# EAGLE design v2-carb-sync-shield (EAGLE 6.4)
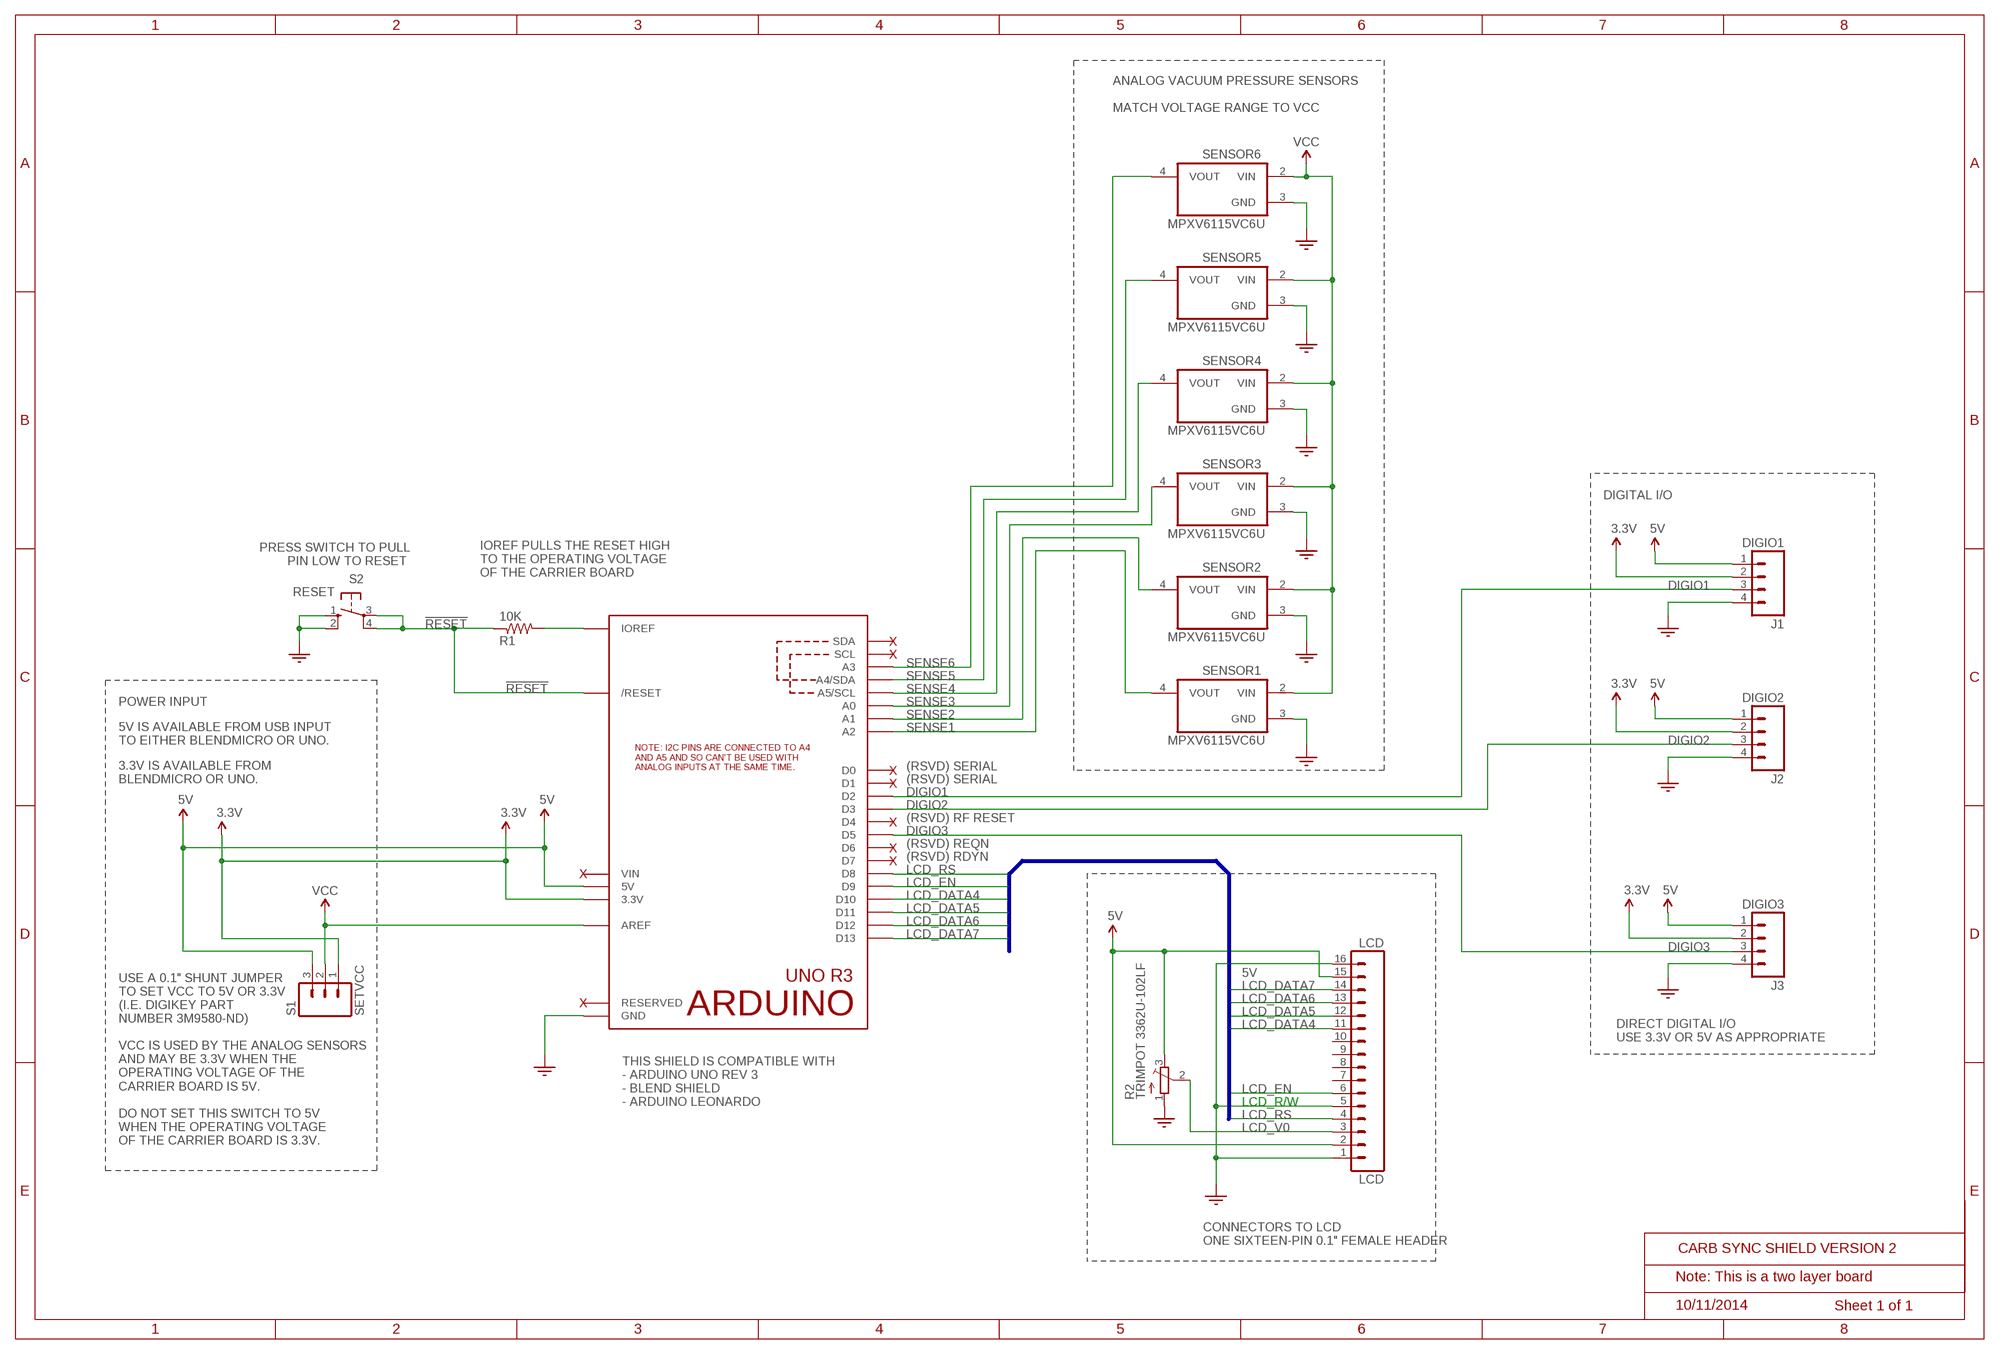
[diagram p0: schematic, sheet 1]

## Parts
J1  DIGIO1  M04LONGPADS  [1X04_LONGPADS]
J2  DIGIO2  M04LONGPADS  [1X04_LONGPADS]
J3  DIGIO3  M04LONGPADS  [1X04_LONGPADS]
LCD  LCD  CARBSYNCSHIELD_LCD  [CARBSYNCSHIELD_LCD]
R1  10K  R-US_0411/12  [0411/12]
R2  TRIMPOT 3362U-102LF  TRIMPOT3386  [TRIM-3386]
S1  SETVCC  M03LONGPADS  [1X03_LONGPADS]
S2  RESET  10-XX  [B3F-10XX]
SENSOR1  MPXV6115VC6U  [MPXV6115VC6U/T1-CASE482A]
SENSOR2  MPXV6115VC6U  [MPXV6115VC6U/T1-CASE482A]
SENSOR3  MPXV6115VC6U  [MPXV6115VC6U/T1-CASE482A]
SENSOR4  MPXV6115VC6U  [MPXV6115VC6U/T1-CASE482A]
SENSOR5  MPXV6115VC6U  [MPXV6115VC6U/T1-CASE482A]
SENSOR6  MPXV6115VC6U  [MPXV6115VC6U/T1-CASE482A]
U$13  ARDUINO-UNO-R3  [ARDUINO-UNO-R3-HOLES-NODIM]

## Nets
3.3V: J1.2 J2.2 J3.2 S1.1 U$13.3V(3.3V)
5V: J1.1 J2.1 J3.1 LCD.2 LCD.15 R2.3(E) S1.3 U$13.5V
!RESET: R1.1 S2.3(P) S2.4(P1) U$13.RESET(/RESET)
DIGIO1: J1.3 U$13.D2
DIGIO2: J2.3 U$13.D3
DIGIO3: J3.3 U$13.D5
GND: J1.4 J2.4 J3.4 LCD.1 LCD.5 LCD.16 R2.1(A) S2.1(S) S2.2(S1) SENSOR1.3(GND) SENSOR2.3(GND) SENSOR3.3(GND) SENSOR4.3(GND) SENSOR5.3(GND) SENSOR6.3(GND) U$13.GND U$13.GND1(GND) U$13.GND2(GND)
IOREF: R1.2 U$13.IOREF
LCD_DATA4: LCD.11 U$13.D10
LCD_DATA5: LCD.12 U$13.D11
LCD_DATA6: LCD.13 U$13.D12
LCD_DATA7: LCD.14 U$13.D13
LCD_EN: LCD.6 U$13.D9
LCD_RS: LCD.4 U$13.D8
LCD_V0: LCD.3 R2.2(S)
SENSE1: SENSOR1.4(VOUT) U$13.A2
SENSE2: SENSOR2.4(VOUT) U$13.A1
SENSE3: SENSOR3.4(VOUT) U$13.A0
SENSE4: SENSOR4.4(VOUT) U$13.A5(A5/SCL)
SENSE5: SENSOR5.4(VOUT) U$13.A4(A4/SDA)
SENSE6: SENSOR6.4(VOUT) U$13.A3
VCC: S1.2 SENSOR1.2(VIN) SENSOR2.2(VIN) SENSOR3.2(VIN) SENSOR4.2(VIN) SENSOR5.2(VIN) SENSOR6.2(VIN) U$13.AREF
Unconnected: LCD.7 LCD.8 LCD.9 LCD.10 U$13.D0 U$13.D1 U$13.D4 U$13.D6 U$13.D7 U$13.RESERVED U$13.SCL U$13.SDA

## Buses
LCD_RS,LCD_EN,LCD_DATA4,LCD_DATA5,LCD_DATA6,LCD_DATA7

## Notes on the sheet
- ANALOG VACUUM PRESSURE SENSORS
  
  MATCH VOLTAGE RANGE TO VCC
- DIGITAL I/O
- PRESS SWITCH TO PULL
  PIN LOW TO RESET
- IOREF PULLS THE RESET HIGH
  TO THE OPERATING VOLTAGE
  OF THE CARRIER BOARD
- X
- X
- POWER INPUT
- 5V IS AVAILABLE FROM USB INPUT
  TO EITHER BLENDMICRO OR UNO.
- X | (RSVD) SERIAL
- 3.3V IS AVAILABLE FROM 
  BLENDMICRO OR UNO.
- X | (RSVD) SERIAL
- X | (RSVD) RF RESET
- X | (RSVD) REQN
- X | (RSVD) RDYN
- X
- X
- DIRECT DIGITAL I/O 
  USE 3.3V OR 5V AS APPROPRIATE
- THIS SHIELD IS COMPATIBLE WITH
  - ARDUINO UNO REV 3
  - BLEND SHIELD
  - ARDUINO LEONARDO
- LCD_R/W
- USE A 0.1" SHUNT JUMPER 
  TO SET VCC TO 5V OR 3.3V
  (I.E. DIGIKEY PART 
  NUMBER 3M9580-ND)
  
  VCC IS USED BY THE ANALOG SENSORS
  AND MAY BE 3.3V WHEN THE 
  OPERATING VOLTAGE OF THE
  CARRIER BOARD IS 5V.
  
  DO NOT SET THIS SWITCH TO 5V
  WHEN THE OPERATING VOLTAGE
  OF THE CARRIER BOARD IS 3.3V.
- CONNECTORS TO LCD
  ONE SIXTEEN-PIN 0.1" FEMALE HEADER
- CARB SYNC SHIELD VERSION 2
- Note: This is a two layer board
- 10/11/2014 | Sheet 1 of 1

## Power pins joined to a net without a drawn wire
VIN: U$13.VIN

## Library data of the parts
J1-J3 = SparkFun-Connectors:M04: Header 4 Standard 4-pin 0.1" header. Use with straight break away headers (SKU : PRT-00116), right angle break away headers (PRT-00553), swiss pins (PRT-00743), machine pins (PRT-00117), and female headers (PRT-00115). Molex polarized connector foot print use with SKU : PRT-08231 with associated crimp pins and housings. 1MM SMD Version SKU: PRT-10208
LCD = v2-carb-sync-shield:CARBSYNCSHIELD_LCD
R1 = adafruit:R-US_: RESISTOR, American symbol
R2 = adafruit:TRIMPOT: SMT trimmer potentiometer part number TC33X http://www.ladyada.net/library/eagle
S1 = SparkFun-Connectors:M03: Header 3 Standard 3-pin 0.1" header. Use with straight break away headers (SKU : PRT-00116), right angle break away headers (PRT-00553), swiss pins (PRT-00743), machine pins (PRT-00117), and female headers (PRT-00115). Molex polarized connector foot print use with SKU : PRT-08232 with associated crimp pins and housings.
S2 = switch-omron:10-XX: OMRON SWITCH; MPN: B3F-1000; OC_FARNELL: 176432; OC_NEWARK: 36M3542
SENSOR1-SENSOR6 = carbsyncshield:MPXV6115VC6U
U$13 = carbsyncshield:ARDUINO-UNO-R3

## Board
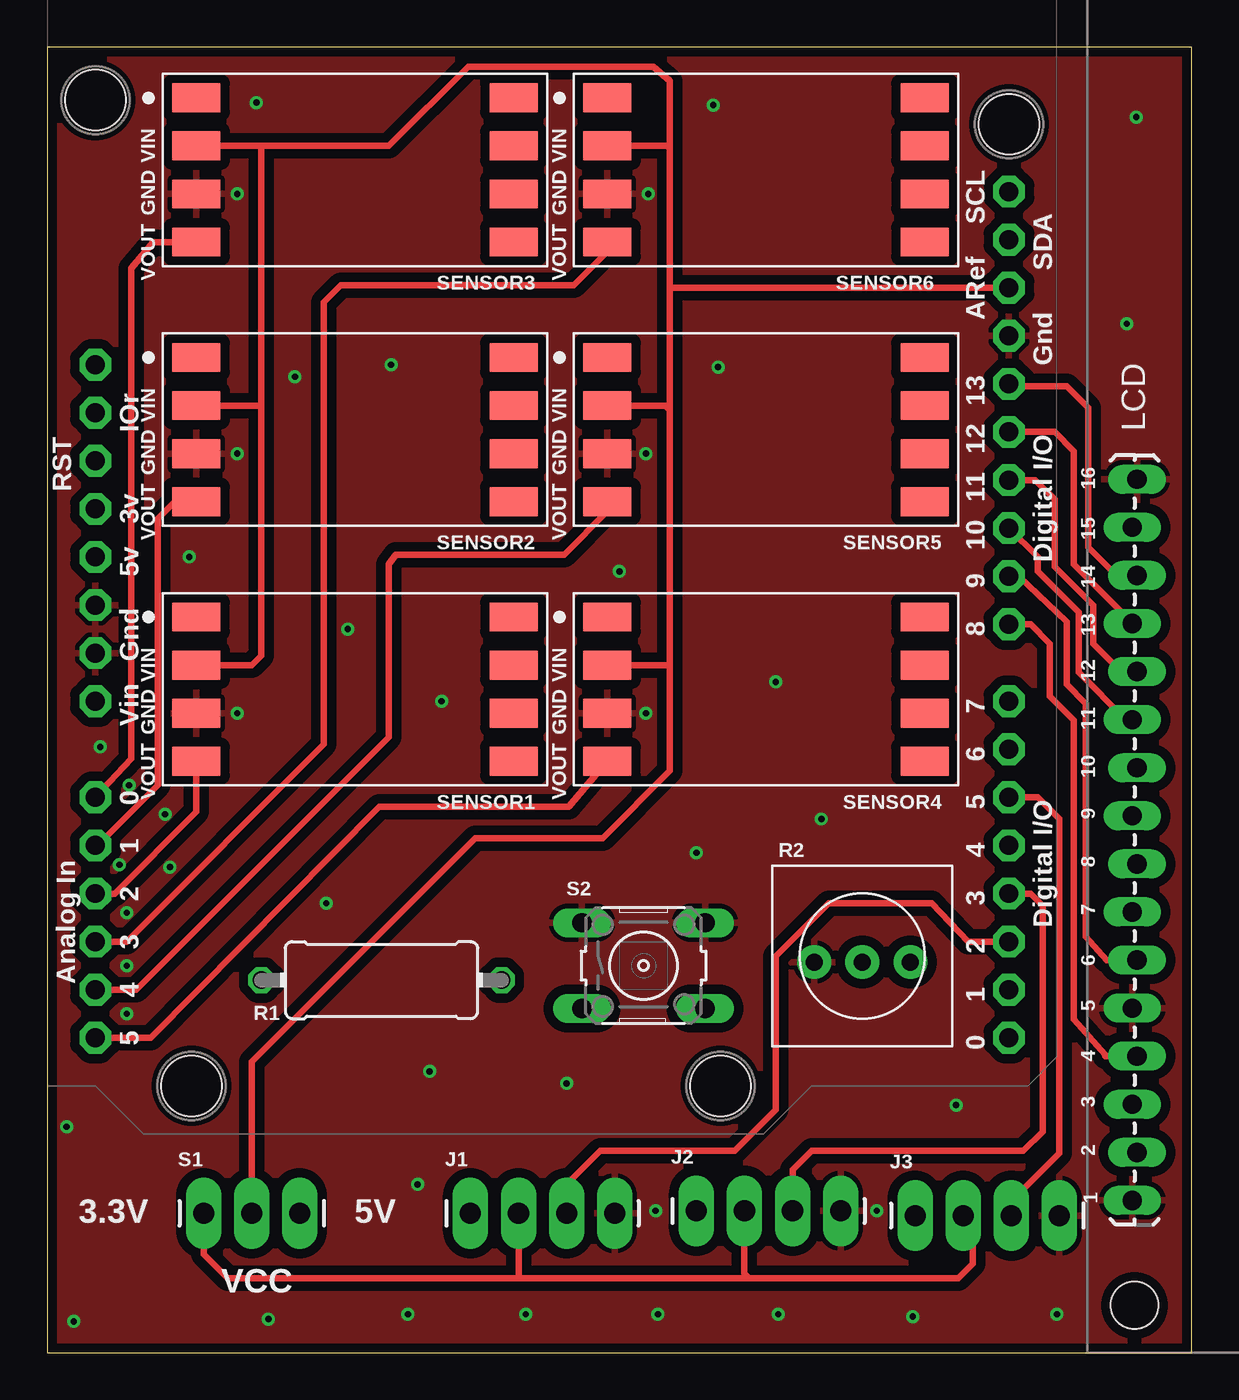
[diagram p1: board, top side]
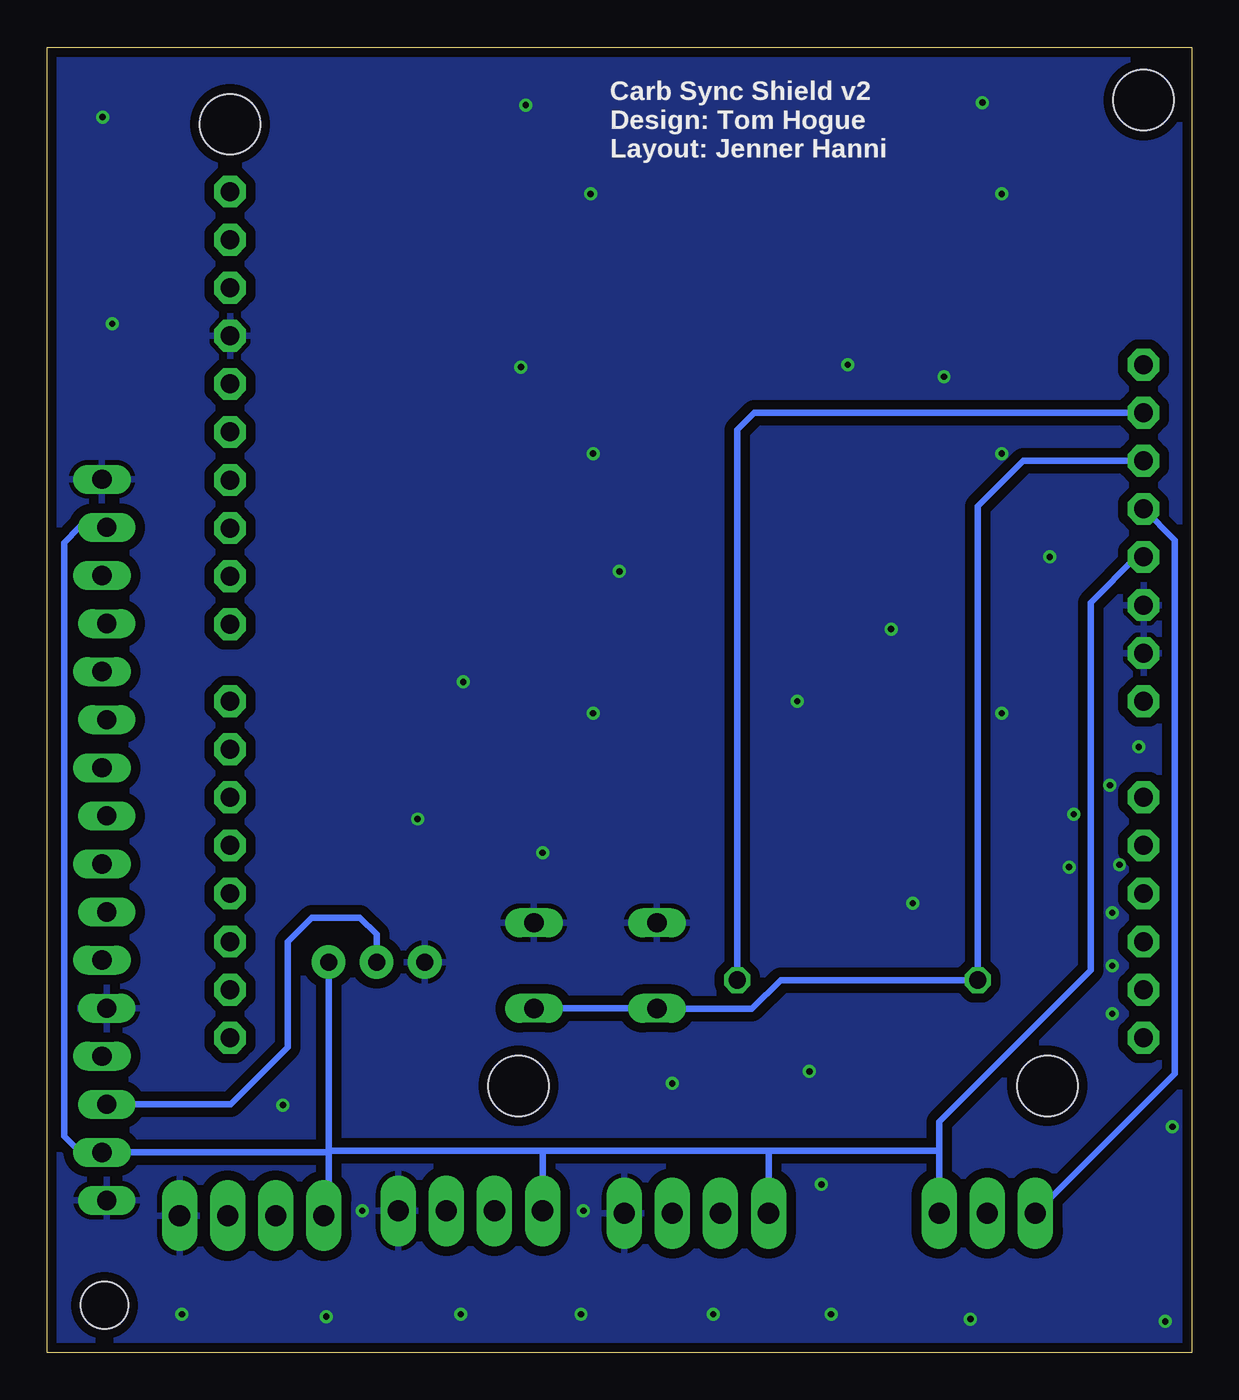
[diagram p2: board, bottom side, seen from below]

Size 60.45 x 68.96 mm. Coordinates in mm from the lower left corner, seen from the top.
Outline: 60.45,68.96 0,68.96 0,0 60.45,0 60.45,68.96
Copper layers (1*16): Top 0.0356mm / dielectric 1.5011mm / Bottom 0.0356mm
Design rules "LaenPCBOrder": minimum track width 6mil, minimum drill 13mil, track to track 6mil, track to pad 6mil, pad to pad 6mil, via to via 6mil, smd to smd 6mil, copper to edge 15mil, drill to drill 6mil, minimum pad ring 7mil, minimum via ring 7mil, stop-mask expansion 3mil, vias tented up to drill 0mil, thermal gap 10mil

### Footprints (pad centres in the part's own frame; a part is rotated, then mirrored left to right if it is on the bottom)
1X04_LONGPADS = drill 1.118 pad 1.88 long: 1 0,0; 2 2.54,0; 3 5.08,0; 4 7.62,0
CARBSYNCSHIELD_LCD = drill 1.016 long: 1 8.041,33.619; 2 10.581,33.365; 3 13.121,33.619; 4 15.661,33.365; 5 18.201,33.619; 6 20.741,33.365; 7 23.281,33.619; 8 25.821,33.365; 9 28.361,33.619; 10 30.901,33.365; 11 33.441,33.619; 12 35.981,33.365; 13 38.521,33.619; 14 41.061,33.365; 15 43.601,33.619; 16 46.141,33.365 | hole 2.5: 2.5,33.5
0411/12 = drill 0.914 octagon: 1 -6.35,0; 2 6.35,0
TRIM-3386 = drill 0.9 pad 1.778: 1 -2.54,-0.318; 2 0,-0.318; 3 2.54,-0.318
1X03_LONGPADS = drill 1.118 pad 1.88 long: 1 0,0; 2 2.54,0; 3 5.08,0
B3F-10XX = drill 1.016 long: 1 -3.251,2.261; 2 3.251,2.261; 3 -3.251,-2.261; 4 3.251,-2.261
MPXV6115VC6U/T1-CASE482A = smd 2.54 x 1.524: 1 8.382,-3.81; 2 8.382,-1.27; 3 8.382,1.27; 4 8.382,3.81; 5 -8.382,3.81; 6 -8.382,1.27; 7 -8.382,-1.27; 8 -8.382,-3.81
ARDUINO-UNO-R3-HOLES-NODIM = drill 1 pad 1.676 octagon: 3V 35.687,2.413; 5V 38.227,2.413; A0 50.927,2.413; A1 53.467,2.413; A2 56.007,2.413; A3 58.547,2.413; A4 61.087,2.413; A5 63.627,2.413; AREF 24.003,50.673; D0 63.627,50.673; D1 61.087,50.673; D2 58.547,50.673; D3 56.007,50.673; D4 53.467,50.673; D5 50.927,50.673; D6 48.387,50.673; D7 45.847,50.673; D8 41.783,50.673; D9 39.243,50.673; D10 36.703,50.673; D11 34.163,50.673; D12 31.623,50.673; D13 29.083,50.673; GND 26.543,50.673; GND1 43.307,2.413; GND2 40.767,2.413; IOREF 30.607,2.413; RESERVED 28.067,2.413; RESET 33.147,2.413; SCL 18.923,50.673; SDA 21.463,50.673; VIN 45.847,2.413 | hole 3.2: 15.367,50.673; 14.097,2.413; 66.167,7.493; 66.167,35.433

### Placement (x,y rotation side)
J1  22.35,7.37 0 top
J2  34.29,7.49 0 top
J3  45.85,7.24 0 top
LCD  90.93,0 90 top
R1  17.65,19.68 0 top
R2  43.05,20.95 0 top
S1  8.26,7.37 0 top
S2  31.5,20.45 0 top
SENSOR1  16.26,35.05 180 top
SENSOR2  16.26,48.77 180 top
SENSOR3  16.26,62.48 180 top
SENSOR4  37.97,35.05 180 top
SENSOR5  37.97,48.77 180 top
SENSOR6  37.97,62.48 180 top
U$13  0.13,80.26 270 top

### Tracks (layer width: path | path; a pad name or v marks a point on that pad's centre or on a via)
3.3V
  Top 0.33: S1.1 8.26,5.21 9.53,3.94 24.77,3.94 | 24.77,3.94 37.08,3.94 | 37.08,3.94 48.13,3.94 48.9,4.7 48.9,7.11 J3.2 | J2.2 36.83,4.19 37.08,3.94 | J1.2 24.89,4.06 24.77,3.94
  Bottom 0.33: U$13.3V 0.89,42.93 0.89,14.73 S1.1
5V
  Bottom 0.33: LCD.15 58.76,43.6 59.56,42.8 59.56,11.43 58.71,10.58 LCD.2 45.63,10.58 45.59,10.54 | U$13.5V 2.92,42.04 5.33,39.62 5.33,20.19 13.34,12.19 13.34,10.67 | 13.34,10.67 S1.3 | R2.3 45.59,10.67 | 45.59,10.67 45.59,10.54 | 13.34,10.67 22.35,10.67 | 22.35,10.67 34.42,10.67 | 34.42,10.67 45.59,10.67 | J2.1 34.29,10.54 34.42,10.67 | J1.1 22.35,10.67 | 45.59,10.54 45.59,7.49 J3.1
!RESET
  Bottom 0.33: S2.4 S2.3 27.84,18.16 23.24,18.16 21.72,19.68 R1.1 11.3,44.7 8.89,47.12 U$13.RESET
DIGIO1
  Top 0.33: U$13.D2 48.64,21.72 46.74,23.75 41.27,23.75 38.48,20.95 38.48,12.83 36.32,10.67 29.21,10.67 27.43,8.89 J1.3
DIGIO2
  Top 0.33: U$13.D3 51.94,24.26 52.58,23.62 52.58,11.68 51.56,10.67 40.39,10.67 39.37,9.65 J2.3
DIGIO3
  Top 0.33: U$13.D5 52.32,29.34 53.47,28.19 53.47,10.54 50.93,8 J3.3
GND  (via drill 0.33 pad 0.46)
  other vias: 10.03,61.21 31.75,61.21 31.62,47.5 10.03,47.5 31.62,33.78 10.03,33.78 11.05,66.04 35.18,65.91 35.43,52.07 18.16,52.2 13.08,51.56 7.49,42.04 57.53,65.28 57.02,54.36 48.01,13.08 27.43,14.22 20.19,14.86 14.73,23.75 20.83,34.42 15.88,38.23 38.48,35.43 30.23,41.28 19.05,2.03 25.27,2.03 32.26,2.03 38.61,2.03 45.72,1.91 53.34,2.03 11.68,1.78 1.4,1.65 1.02,11.94 34.29,26.42 40.89,28.19 3.81,25.78 6.22,28.45 6.48,25.65 4.19,20.45 4.19,17.91 4.19,23.24 4.32,29.97 2.79,32 32.13,7.49 19.56,8.89 43.81,7.49
  pour Top (isolate 0.508, rank 5): 60.45,0 60.58,69.34 -0.13,69.21 0.13,0
  pour Bottom (isolate 0.508, rank 5): 60.45,0 60.58,69.34 0.13,69.47 0.13,0
IOREF
  Bottom 0.33: U$13.IOREF 23.11,49.66 24,48.77 R1.2
LCD_DATA4
  Top 0.33: LCD.11 56.98,33.44 54.48,35.94 54.48,39.12 52.32,41.28 52.32,42.04 U$13.D10
LCD_DATA5
  Top 0.33: LCD.12 56.73,35.98 55.24,37.47 55.24,39.5 53.21,41.53 53.21,45.09 52.2,46.1 U$13.D11
LCD_DATA6
  Top 0.33: LCD.13 57.31,38.57 54.23,41.66 54.23,47.62 53.21,48.64 U$13.D12
LCD_DATA7
  Top 0.33: LCD.14 56.48,41.06 54.99,42.55 54.99,49.91 53.85,51.05 50.93,51.05 U$13.D13
LCD_EN
  Top 0.33: U$13.D9 51.31,41.02 53.85,38.61 53.85,35.31 54.86,34.29 54.86,21.97 55.97,20.74 LCD.6
LCD_RS
  Top 0.33: U$13.D8 51.94,38.48 52.96,37.47 52.96,34.67 54.23,33.4 54.23,17.6 55.88,15.75 55.88,15.66 LCD.4
LCD_V0
  Bottom 0.33: LCD.3 50.76,13.12 47.75,16.13 47.75,21.72 46.48,22.99 43.94,22.99 43.05,22.1 R2.2
SENSE1
  Top 0.33: U$13.A2 3.56,24.26 7.87,28.57 SENSOR1.4
SENSE2
  Top 0.33: U$13.A1 2.67,26.8 5.84,29.97 5.84,44.07 6.73,44.96 SENSOR2.4
SENSE3
  Top 0.33: SENSOR3.4 5.59,58.67 4.45,57.28 4.45,31.37 U$13.A0
SENSE4
  Top 0.33: U$13.A5 5.46,16.64 17.53,28.83 27.56,28.83 SENSOR4.4
SENSE5
  Top 0.33: U$13.A4 4.7,19.18 18.03,32.51 18.03,41.66 18.41,42.16 27.3,42.16 29.59,44.45 SENSOR5.4
SENSE6
  Top 0.33: SENSOR6.4 29.59,58.17 27.81,56.39 15.49,56.39 14.61,55.5 14.61,32.13 4.19,21.72 U$13.A3
VCC
  Top 0.33: 11.43,63.75 18.03,63.75 22.23,67.94 32,67.94 32.89,67.18 32.89,63.63 | 32.89,63.63 32.89,56.26 | 32.89,56.26 32.89,49.78 | 32.89,49.78 32.89,36.32 | SENSOR6.2 32.77,63.75 32.89,63.63 | SENSOR5.2 32.64,50.04 32.89,49.78 | SENSOR4.2 32.89,36.32 | SENSOR1.2 10.79,36.32 11.3,36.83 11.3,50.04 | 11.3,50.04 11.3,63.63 11.43,63.75 | SENSOR2.2 11.3,50.04 | 32.89,36.32 32.89,30.73 29.34,27.18 22.61,27.18 10.79,15.37 S1.2 | SENSOR3.2 11.43,63.75 | U$13.AREF 32.89,56.26

### Text on the board
tNames: 3.3V | 5V | VCC
bNames: Carb Sync Shield v2 / Design: Tom Hogue / Layout: Jenner Hanni